# EAGLE design menorah_0.1 (EAGLE 5.03)
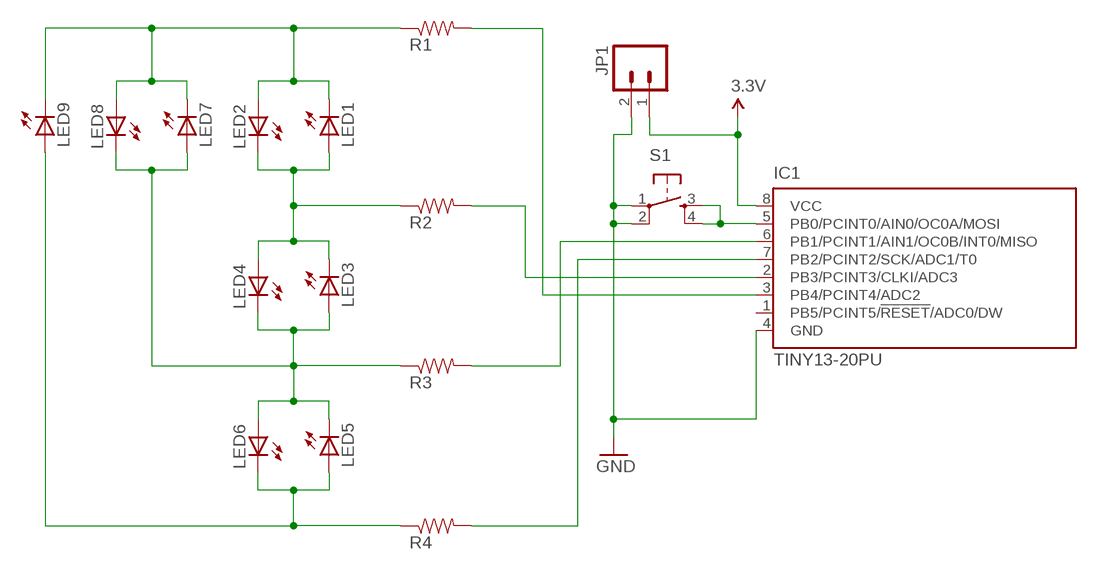
[diagram p0: schematic, sheet 1]

## Parts
IC1  TINY13-20PU  [DIL08]
JP1  M02PTH  [1X02]
LED1  LED5MM  [LED5MM]
LED2  LED5MM  [LED5MM]
LED3  LED5MM  [LED5MM]
LED4  LED5MM  [LED5MM]
LED5  LED5MM  [LED5MM]
LED6  LED5MM  [LED5MM]
LED7  LED5MM  [LED5MM]
LED8  LED5MM  [LED5MM]
LED9  LED5MM  [LED5MM]
R1  RESISTORPTH1  [AXIAL-0.3]
R2  RESISTORPTH1  [AXIAL-0.3]
R3  RESISTORPTH1  [AXIAL-0.3]
R4  RESISTORPTH1  [AXIAL-0.3]
S1  TAC_SWITCHPTH  [TACTILE-PTH]

## Nets
3.3V: IC1.8(VCC) JP1.1
GND: IC1.4(GND) JP1.2 S1.1 S1.2
N$1: LED1.K(C) LED2.A LED7.K(C) LED8.A LED9.K(C) R1.P$1
N$3: LED1.A LED2.K(C) LED3.K(C) LED4.A R2.P$1
N$6: LED5.A LED6.K(C) LED9.A R4.P$1
N$8: LED3.A LED4.K(C) LED5.K(C) LED6.A LED7.A LED8.K(C) R3.P$1
N$11: IC1.3(PB4/PCINT4/ADC2) R1.P$2
N$12: IC1.2(PB3/PCINT3/CLKI/ADC3) R2.P$2
N$13: IC1.6(PB1/PCINT1/AIN1/OC0B/INT0/MISO) R3.P$2
N$14: IC1.7(PB2/PCINT2/SCK/ADC1/T0) R4.P$2
N$15: IC1.5(PB0/PCINT0/AIN0/OC0A/MOSI) S1.3 S1.4
Unconnected: IC1.1(PB5/PCINT5/!RESET!/ADC0/DW)

## Library data of the parts
IC1 = atmel:TINY13: 8-bit AVR Microcontroller with 1K Bytes In-System Programmable Flash Source: http://www.atmel.com/dyn/resources/prod_documents/2535S.pdf
JP1 = SparkFun:M02: Header 2 Standard 2-pin 0.1" header. Use with straight break away headers (SKU : PRT-00116), right angle break away headers (PRT-00553), swiss pins (PRT-00743), machine pins (PRT-00117), and female headers (PRT-00115). Molex polarized connector foot print use with SKU : PRT-08233 with associated crimp pins and housings.
LED1-LED9 = SparkFun:LED: LEDs Standard schematic elements and footprints for 5mm, 3mm, 1206, and 0603 sized LEDs. 5mm - Spark Fun Electronics SKU : COM-00529 (and others)
R1-R4 = SparkFun:RESISTOR: Resistor Basic schematic elements and footprints for 0603, 1206, and PTH 1/10th watt (small) resistors.
S1 = SparkFun:TAC_SWITCH: Momentary Switch Button commonly used for reset or general input. Spark Fun Electronics SKU : COM-00097

## Board
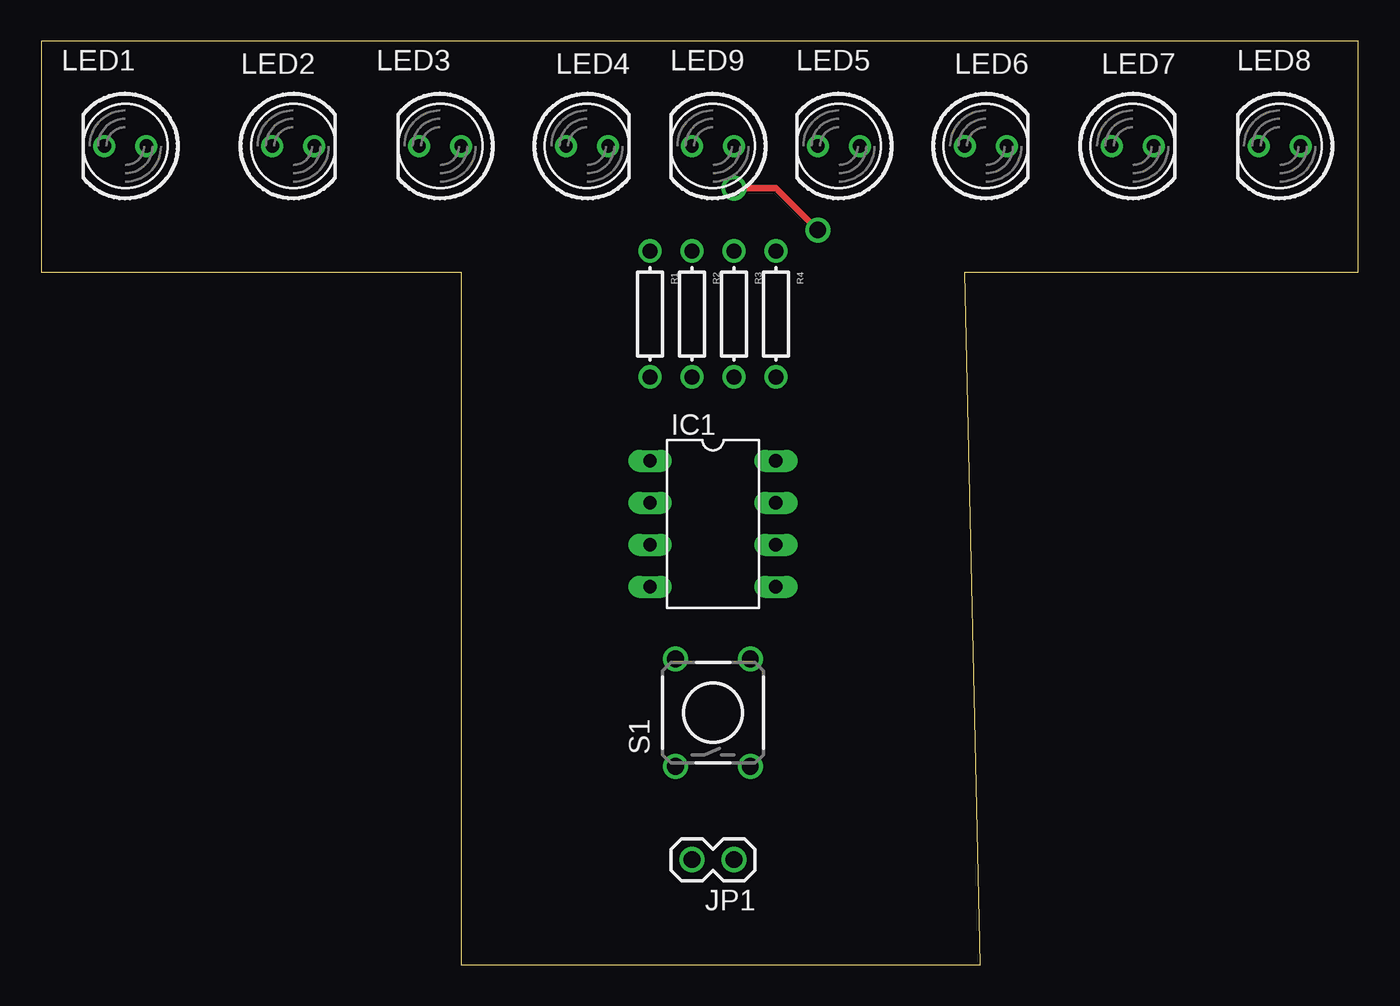
[diagram p1: board, top side]
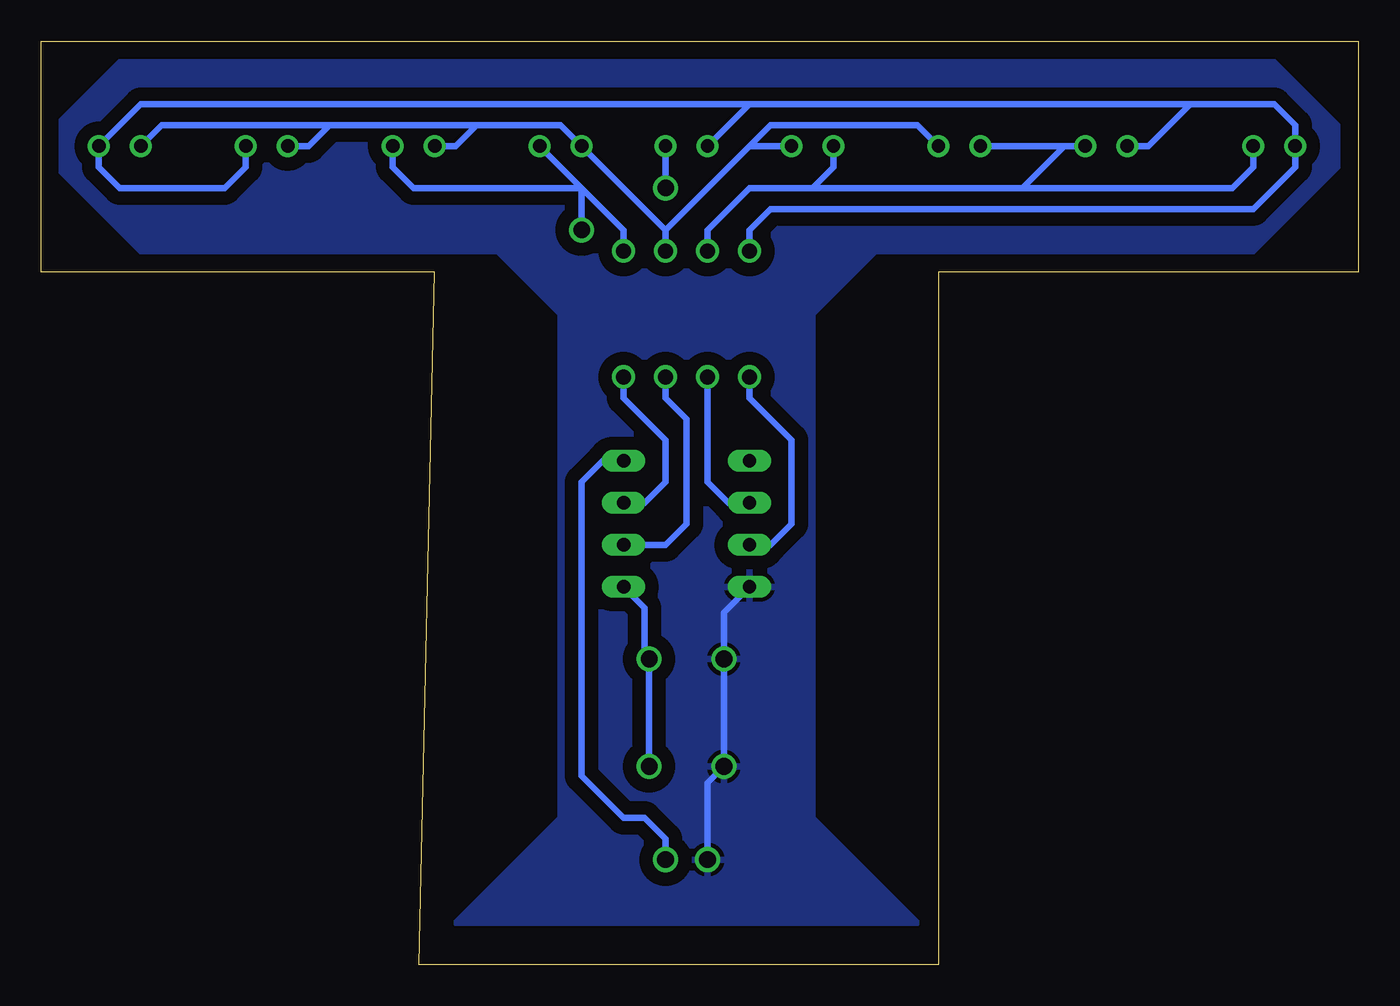
[diagram p2: board, bottom side, seen from below]

Size 79.68 x 55.87 mm. Coordinates in mm from the lower left corner, seen from the top.
Outline: 25.4,0 56.82,0 55.88,41.91 79.68,41.91 79.68,55.87 0,55.87 0,41.91 25.4,41.91 25.4,0
Copper layers (1*16): Top 0.035mm / dielectric 1.5mm / Bottom 0.035mm
Design rules "default": minimum track width 10mil, minimum drill 24mil, track to track 8mil, track to pad 8mil, pad to pad 8mil, via to via 8mil, smd to smd 8mil, copper to edge 40mil, drill to drill 8mil, minimum pad ring 10mil, minimum via ring 8mil, stop-mask expansion 4mil, vias tented up to drill 0mil, thermal gap 10mil

### Footprints (pad centres in the part's own frame; a part is rotated, then mirrored left to right if it is on the bottom)
DIL08 = drill 0.813 long: 1 -3.81,-3.81; 2 -1.27,-3.81; 3 1.27,-3.81; 4 3.81,-3.81; 5 3.81,3.81; 6 1.27,3.81; 7 -1.27,3.81; 8 -3.81,3.81
1X02 = drill 1.016 round: 1 0,0; 2 2.54,0
LED5MM = drill 0.813 round: A -1.27,0; K 1.27,0
AXIAL-0.3 = drill 0.9 round: P$1 -3.81,0; P$2 3.81,0
TACTILE-PTH = drill 1.016 round: 1 -3.251,2.261; 2 3.251,2.261; 3 -3.251,-2.261; 4 3.251,-2.261

### Placement (x,y rotation side)
IC1  40.64,26.67 270 top
JP1  41.91,6.35 180 top
LED1  5.08,49.53 180 top
LED2  15.24,49.53 0 top
LED3  24.13,49.53 180 top
LED4  33.02,49.53 0 top
LED5  48.26,49.53 180 top
LED6  57.15,49.53 0 top
LED7  66.04,49.53 0 top
LED8  74.93,49.53 180 top
LED9  40.64,49.53 180 top
R1  36.83,39.37 270 top
R2  39.37,39.37 270 top
R3  41.91,39.37 270 top
R4  44.45,39.37 270 top
S1  40.64,15.24 90 top

### Tracks (layer width: path | path; a pad name or v marks a point on that pad's centre or on a via)
3.3V
  Bottom 0.406: JP1.1 41.91,7.62 43.18,8.89 44.45,8.89 46.99,11.43 46.99,29.21 45.72,30.48 IC1.8
GND
  Bottom 0.406: JP1.2 39.37,11 S1.1 S1.2 38.38,21.31 IC1.4
  pour Bottom (isolate 0.813): 5.08,54.61 1.27,50.8 1.27,48.26 6.35,43.18 29.21,43.18 33.02,39.37 33.02,8.89 26.67,2.54 54.61,2.54 48.26,8.89 48.26,39.37 52.07,43.18 73.66,43.18 78.74,48.26 78.74,50.8 74.93,54.61
N$1
  Bottom 0.406: 29.21,45.72 6.35,45.72 3.81,48.26 LED1.K 3.81,50.8 5.08,52.07 10.16,52.07 | 29.21,45.72 30.48,45.72 | R1.P$1 36.83,44.45 35.56,45.72 29.21,45.72 | LED2.A 12.7,49.53 10.16,52.07 | 10.16,52.07 36.83,52.07 | 36.83,52.07 LED9.K | LED7.K 67.31,48.26 68.58,46.99 74.93,46.99 76.2,48.26 LED8.A 73.66,52.07 36.83,52.07
N$3
  Bottom 0.406: LED1.A 6.35,48.26 7.62,46.99 20.32,46.99 | 20.32,46.99 33.02,46.99 | LED4.A 31.75,48.26 33.02,46.99 | 20.32,46.99 17.78,49.53 LED2.K LED3.K | R2.P$1 39.37,44.45 36.83,46.99 33.02,46.99
N$6  (via drill 1)
  Top 0.406: v41.91,46.99 44.45,46.99 v46.99,44.45
  Bottom 0.406: R4.P$1 44.45,44.45 46.99,46.99 | 46.99,46.99 LED5.A | LED6.K 58.42,48.26 57.15,46.99 46.99,46.99 | v41.91,46.99 LED9.A | 46.99,46.99 v46.99,44.45
N$8
  Bottom 0.406: LED3.A 26.67,50.8 35.56,50.8 36.83,49.53 | 41.91,44.45 R3.P$1 | 41.91,44.45 LED5.K 48.26,50.8 53.34,50.8 | 36.83,49.53 LED4.K | 36.83,49.53 41.91,44.45 | 53.34,50.8 62.23,50.8 | 62.23,50.8 72.39,50.8 LED8.K | LED6.A 54.61,49.53 53.34,50.8 | LED7.A 63.5,49.53 62.23,50.8
N$11
  Bottom 0.406: IC1.3 35.56,25.4 34.29,26.67 34.29,31.75 36.83,34.29 R1.P$2
N$12
  Bottom 0.406: IC1.2 38.1,27.94 39.37,29.21 R2.P$2
N$13
  Bottom 0.406: IC1.6 41.91,25.4 40.64,26.67 40.64,33.02 41.91,34.29 R3.P$2
N$14
  Bottom 0.406: IC1.7 43.18,27.94 41.91,29.21 41.91,31.75 44.45,34.29 R4.P$2
N$15
  Bottom 0.406: IC1.5 43.18,21.59 43.18,18.77 S1.4 S1.3